# Altium schematic sheet RGB Video Output.SchDoc
size A4; DocumentNumber: 4; SheetNumber: 6; SheetTotal: 7
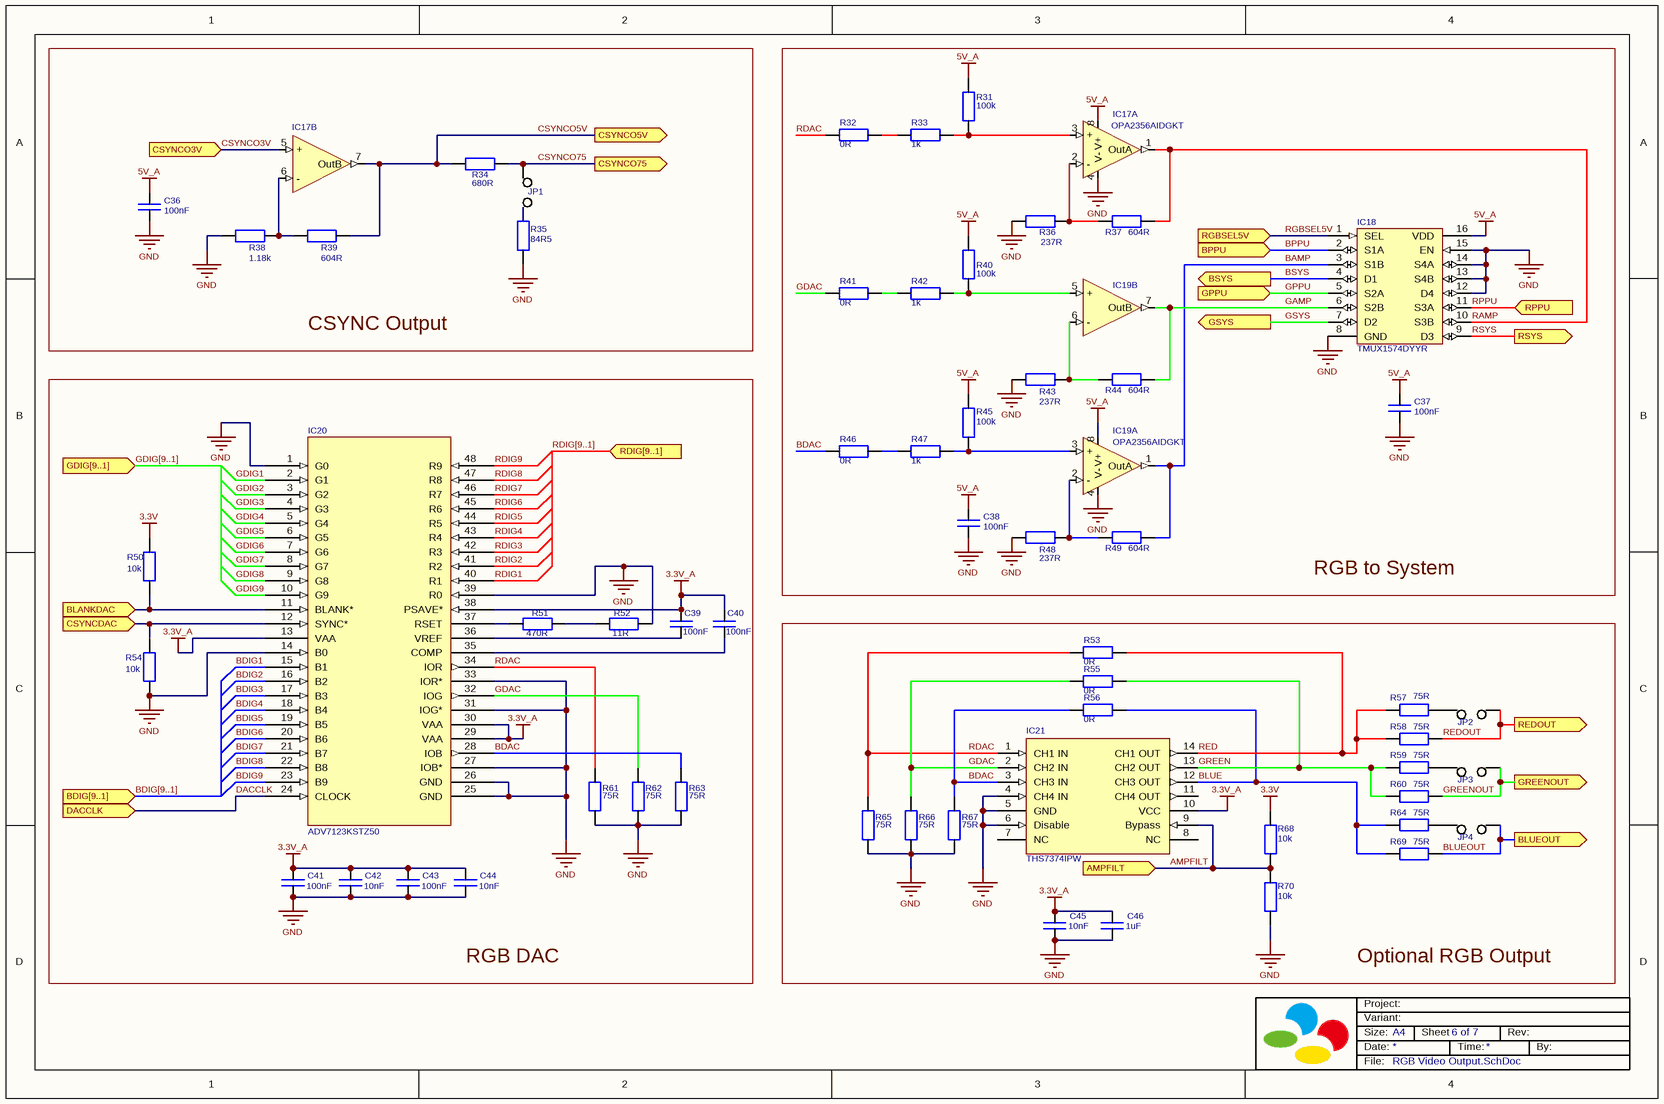
[diagram p0: RGB Video Output.SchDoc]

## Parts
C36  value 100nF  [Cap_0402_Chip]  (hidden comment: Ceramic Capacitor 100nF 10V ±20% X7R 0402)
C37  value 100nF  [Cap_0402_Chip]  (hidden comment: Ceramic Capacitor 100nF 10V ±20% X7R 0402)
C38  value 100nF  [Cap_0402_Chip]  (hidden comment: Ceramic Capacitor 100nF 10V ±20% X7R 0402)
C39  value 100nF  [Cap_0402_Chip]  (hidden comment: Ceramic Capacitor 100nF 10V ±20% X7R 0402)
C40  value 100nF  [Cap_0402_Chip]  (hidden comment: Ceramic Capacitor 100nF 10V ±20% X7R 0402)
C41  value 100nF  [Cap_0402_Chip]  (hidden comment: Ceramic Capacitor 100nF 10V ±20% X7R 0402)
C42  value 10nF  [Cap_0402_Chip]  (hidden comment: Ceramic Capacitor 10nF 10V ±20% X7R 0402)
C43  value 100nF  [Cap_0402_Chip]  (hidden comment: Ceramic Capacitor 100nF 10V ±20% X7R 0402)
C44  value 10nF  [Cap_0402_Chip]  (hidden comment: Ceramic Capacitor 10nF 10V ±20% X7R 0402)
C45  value 10nF  [Cap_0402_Chip]  (hidden comment: Ceramic Capacitor 10nF 10V ±20% X7R 0402)
C46  value 1uF  [Cap_0603_Chip]  (hidden comment: Ceramic Capacitor 1uF 10V ±20% X7R 0603)
IC17  Manufacturer_Part_Number: OPA2356AIDGKT  [MSOP8]  (hidden comment: OPA2356)  (parts A,B of 2)
IC18  Manufacturer_Part_Number: TMUX1574DYYR  [SOT-23THIN16]  (hidden comment: TMUX1574)
IC19  Manufacturer_Part_Number: OPA2356AIDGKT  [MSOP8]  (hidden comment: OPA2356)  (parts A,B of 2)
IC20  Manufacturer_Part_Number: ADV7123KSTZ50  [ST_48_ADI]  (hidden comment: ADV7123)
IC21  Manufacturer_Part_Number: THS7374IPW  [TSSOP14]  (hidden comment: THS7374)
JP1  Jumper  [Jumper]  (value not drawn)  (no BOM)
JP2  Jumper  [Jumper]  (value not drawn)  (no BOM)
JP3  Jumper  [Jumper]  (value not drawn)  (no BOM)
JP4  Jumper  [Jumper]  (value not drawn)  (no BOM)
R31  value 100k  [Res_0402_Chip]  (hidden comment: Resistor 100k 0402 ±1%)
R32  value 0R  [Res_0402_Chip]  (hidden comment: Resistor 0R 0402)
R33  value 1k  [Res_0402_Chip]  (hidden comment: Resistor 1k 0402 ±1%)
R34  value 680R  [Res_0603_Chip]  (hidden comment: Resistor 680R 0603 ±1%)
R35  value 84R5  [Res_0402_Chip]  (hidden comment: Resistor 84R5 0402 ±1%)
R36  value 237R  [Res_0402_Chip]  (hidden comment: Resistor 237R 0402 ±1%)
R37  value 604R  [Res_0402_Chip]  (hidden comment: Resistor 604R 0402 ±1%)
R38  value 1.18k  [Res_0402_Chip]  (hidden comment: Resistor 1.18k 0402 ±1%)
R39  value 604R  [Res_0402_Chip]  (hidden comment: Resistor 604R 0402 ±1%)
R40  value 100k  [Res_0402_Chip]  (hidden comment: Resistor 100k 0402 ±1%)
R41  value 0R  [Res_0402_Chip]  (hidden comment: Resistor 0R 0402)
R42  value 1k  [Res_0402_Chip]  (hidden comment: Resistor 1k 0402 ±1%)
R43  value 237R  [Res_0402_Chip]  (hidden comment: Resistor 237R 0402 ±1%)
R44  value 604R  [Res_0402_Chip]  (hidden comment: Resistor 604R 0402 ±1%)
R45  value 100k  [Res_0402_Chip]  (hidden comment: Resistor 100k 0402 ±1%)
R46  value 0R  [Res_0402_Chip]  (hidden comment: Resistor 0R 0402)
R47  value 1k  [Res_0402_Chip]  (hidden comment: Resistor 1k 0402 ±1%)
R48  value 237R  [Res_0402_Chip]  (hidden comment: Resistor 237R 0402 ±1%)
R49  value 604R  [Res_0402_Chip]  (hidden comment: Resistor 604R 0402 ±1%)
R50  value 10k  [Res_0402_Chip]  (hidden comment: Resistor 10k 0402 ±1%)
R51  value 470R  [Res_0402_Chip]  (hidden comment: Resistor 470R 0402 ±1%)
R52  value 11R  [Res_0402_Chip]  (hidden comment: Resistor 11R 0402 ±1%)
R53  value 0R  [Res_0402_Chip]  (hidden comment: Resistor 0R 0402)
R54  value 10k  [Res_0402_Chip]  (hidden comment: Resistor 10k 0402 ±1%)
R55  value 0R  [Res_0402_Chip]  (hidden comment: Resistor 0R 0402)
R56  value 0R  [Res_0402_Chip]  (hidden comment: Resistor 0R 0402)
R57  value 75R  [Res_0603_Chip]  (hidden comment: Resistor 75R 0603 ±1%)
R58  value 75R  [Res_0603_Chip]  (hidden comment: Resistor 75R 0603 ±1%)
R59  value 75R  [Res_0603_Chip]  (hidden comment: Resistor 75R 0603 ±1%)
R60  value 75R  [Res_0603_Chip]  (hidden comment: Resistor 75R 0603 ±1%)
R61  value 75R  [Res_0402_Chip]  (hidden comment: Resistor 75R 0402 ±1%)
R62  value 75R  [Res_0402_Chip]  (hidden comment: Resistor 75R 0402 ±1%)
R63  value 75R  [Res_0402_Chip]  (hidden comment: Resistor 75R 0402 ±1%)
R64  value 75R  [Res_0603_Chip]  (hidden comment: Resistor 75R 0603 ±1%)
R65  value 75R  [Res_0402_Chip]  (hidden comment: Resistor 75R 0402 ±1%)
R66  value 75R  [Res_0402_Chip]  (hidden comment: Resistor 75R 0402 ±1%)
R67  value 75R  [Res_0402_Chip]  (hidden comment: Resistor 75R 0402 ±1%)
R68  value 10k  [Res_0402_Chip]  (hidden comment: Resistor 10k 0402 ±1%)
R69  value 75R  [Res_0603_Chip]  (hidden comment: Resistor 75R 0603 ±1%)
R70  value 10k  [Res_0402_Chip]  (hidden comment: Resistor 10k 0402 ±1%)

## Blocks framed on the sheet
CSYNC Output: C36 IC17 JP1 R34 R35 R38 R39
RGB to System: C37 C38 IC17-IC19 R31-R33 R36 R37 R40-R49
RGB DAC: C39-C44 IC20 R50-R52 R54 R61-R63
Optional RGB Output: C45 C46 IC21 JP2-JP4 R53 R55-R60 R64-R70

## Ports
AMPFILT (in), BDIG[9..1] (in), BLANKDAC (in), BLUEOUT (out), BPPU (in), BSYS (out), CSYNCDAC (in), CSYNCO3V (in), CSYNCO5V (out), CSYNCO75 (out), DACCLK (in), GDIG[9..1] (in), GPPU (in), GREENOUT (out), GSYS (out), RDIG[9..1] (in), REDOUT (out), RGBSEL5V (in), RPPU (in), RSYS (out)

## Nets
3.3V: R50.2 R68.1
3.3V_A: C39.1 C40.1 C41.2 C42.2 C43.2 C44.2 C45.2 C46.2 IC20.13(VAA) IC20.29(VAA) IC20.30(VAA) IC20.38(PSAVE*) IC21.10(VCC)
5V_A: C36.1 C37.1 C38.1 IC17.8(V+) IC18.16(VDD) IC19.8(V+) R31.2 R40.2 R45.2
GND: C36.2 C37.2 C38.2 C41.1 C42.1 C43.1 C44.1 C45.1 C46.1 IC17.4(V-) IC18.8(GND) IC18.12(D4) IC18.13(S4B) IC18.14(S4A) IC18.15(EN) IC19.4(V-) IC20.1(G0) IC20.14(B0) IC20.25(GND) IC20.26(GND) IC20.27(IOB*) IC20.31(IOG*) IC20.33(IOR*) IC20.39(R0) IC21.4(CH4_IN) IC21.5(GND) IC21.6(Disable) R35.1 R36.1 R38.1 R43.1 R48.2 R52.2 R54.1 R61.1 R62.1 R63.1 R65.1 R66.1 R67.1 R70.2
AMPFILT: IC21.9(Bypass) R68.2 R70.1 ; port AMPFILT
BAMP: IC18.3(S1B) IC19.1(OutA) R49.2
BDAC: IC20.28(IOB) IC21.3(CH3_IN) R46.2 R56.2 R63.2 R67.2
BDIG1: IC20.15(B1)
BDIG2: IC20.16(B2)
BDIG3: IC20.17(B3)
BDIG4: IC20.18(B4)
BDIG5: IC20.19(B5)
BDIG6: IC20.20(B6)
BDIG7: IC20.21(B7)
BDIG8: IC20.22(B8)
BDIG9: IC20.23(B9)
BLANKDAC: IC20.11(BLANK*) R50.1 ; port BLANKDAC
BLUE: IC21.12(CH3_OUT) R56.1 R64.1 R69.1
BLUEOUT: JP4.1 R69.2 ; port BLUEOUT
BPPU: IC18.2(S1A) ; port BPPU
BSYS: IC18.4(D1) ; port BSYS
CSYNCDAC: IC20.12(SYNC*) R54.2 ; port CSYNCDAC
CSYNCO3V: IC17.5(+) ; port CSYNCO3V
CSYNCO5V: IC17.7(OutB) R34.1 R39.1 ; port CSYNCO5V
CSYNCO75: JP1.1 R34.2 ; port CSYNCO75
DACCLK: IC20.24(CLOCK) ; port DACCLK
GAMP: IC18.6(S2B) IC19.7(OutB) R44.1
GDAC: IC20.32(IOG) IC21.2(CH2_IN) R41.2 R55.2 R62.2 R66.2
GDIG1: IC20.2(G1)
GDIG2: IC20.3(G2)
GDIG3: IC20.4(G3)
GDIG4: IC20.5(G4)
GDIG5: IC20.6(G5)
GDIG6: IC20.7(G6)
GDIG7: IC20.8(G7)
GDIG8: IC20.9(G8)
GDIG9: IC20.10(G9)
GPPU: IC18.5(S2A) ; port GPPU
GREEN: IC21.13(CH2_OUT) R55.1 R59.1 R60.1
GREENOUT: JP3.1 R60.2 ; port GREENOUT
GSYS: IC18.7(D2) ; port GSYS
RAMP: IC17.1(OutA) IC18.10(S3B) R37.2
RDAC: IC20.34(IOR) IC21.1(CH1_IN) R32.2 R53.2 R61.2 R65.2
RDIG1: IC20.40(R1)
RDIG2: IC20.41(R2)
RDIG3: IC20.42(R3)
RDIG4: IC20.43(R4)
RDIG5: IC20.44(R5)
RDIG6: IC20.45(R6)
RDIG7: IC20.46(R7)
RDIG8: IC20.47(R8)
RDIG9: IC20.48(R9)
RED: IC21.14(CH1_OUT) R53.1 R57.1 R58.1
REDOUT: JP2.1 R58.2 ; port REDOUT
RGBSEL5V: IC18.1(SEL) ; port RGBSEL5V
RPPU: IC18.11(S3A) ; port RPPU
RSYS: IC18.9(D3) ; port RSYS
NetC39_2: C39.2 IC20.36(VREF)
NetC40_2: C40.2 IC20.35(COMP)
NetIC17_2: IC17.2(-) R36.2 R37.1
NetIC17_3: IC17.3(+) R31.1 R33.1
NetIC17_6: IC17.6(-) R38.2 R39.2
NetIC19_2: IC19.2(-) R48.1 R49.1
NetIC19_3: IC19.3(+) R45.1 R47.1
NetIC19_5: IC19.5(+) R40.1 R42.1
NetIC19_6: IC19.6(-) R43.2 R44.2
NetIC20_37: IC20.37(RSET) R51.1
NetJP1_2: JP1.2 R35.2
NetJP2_2: JP2.2 R57.2
NetJP3_2: JP3.2 R59.2
NetJP4_2: JP4.2 R64.2
NetR32_1: R32.1 R33.2
NetR41_1: R41.1 R42.2
NetR46_1: R46.1 R47.2
NetR51_2: R51.2 R52.1

Not connected (* = marked no-connect by the designer): IC21 7(NC) 8(NC) 11(CH4_OUT)

## Buses and harness runs
bus BDIG[9..1] = port BDIG[9..1]
bus GDIG[9..1] = port GDIG[9..1]
bus RDIG[9..1] = port RDIG[9..1]

## Notes on the sheet
- Size:
- Date:
- Variant:
- Project:
- A4
- Sheet
- Time:
- Rev:
- By:
- File:

## Library data of the parts
C36-C45 = Capacitor: ChipSize: 0402; NominalVoltage: 10V; Dielectric: X7R; Tolerance: ±20%; PartType: Ceramic Capacitor
C46 = Capacitor: ChipSize: 0603; NominalVoltage: 10V; Dielectric: X7R; Tolerance: ±20%; PartType: Ceramic Capacitor
IC17 IC19 = OPA2356: Manufacturer: Texas Instruments
IC18 = TMUX1574: SPDT 4 Ch; Manufacturer: Texas Instruments
IC20 = ADV7123KSTZ140: 10Bit Video DAC; Manufacturer: Analog Devices Inc; Built_By: EMA_UL_Team; SourceLibrary: Analog_2012-01-01_8; Copyright: Copyright (C) 2018 Accelerated Designs. All rights reserved; RefDes: RefDes; Type: DEV
IC21 = THS7374: Manufacturer: Texas Instruments
R31-R33 R35-R56 R61-R63 R65-R68 R70 = R: ChipSize: 0402; PartType: Resistor
  R31 R33 R35-R40 R42-R45 R47-R52 R54 R61-R63 R65-R68 R70: Tolerance: ±1%
R34 R57-R60 R64 R69 = R: ChipSize: 0603; Tolerance: ±1%; PartType: Resistor